# Altium project ArcNano_Project_v1.0.PrjPcb
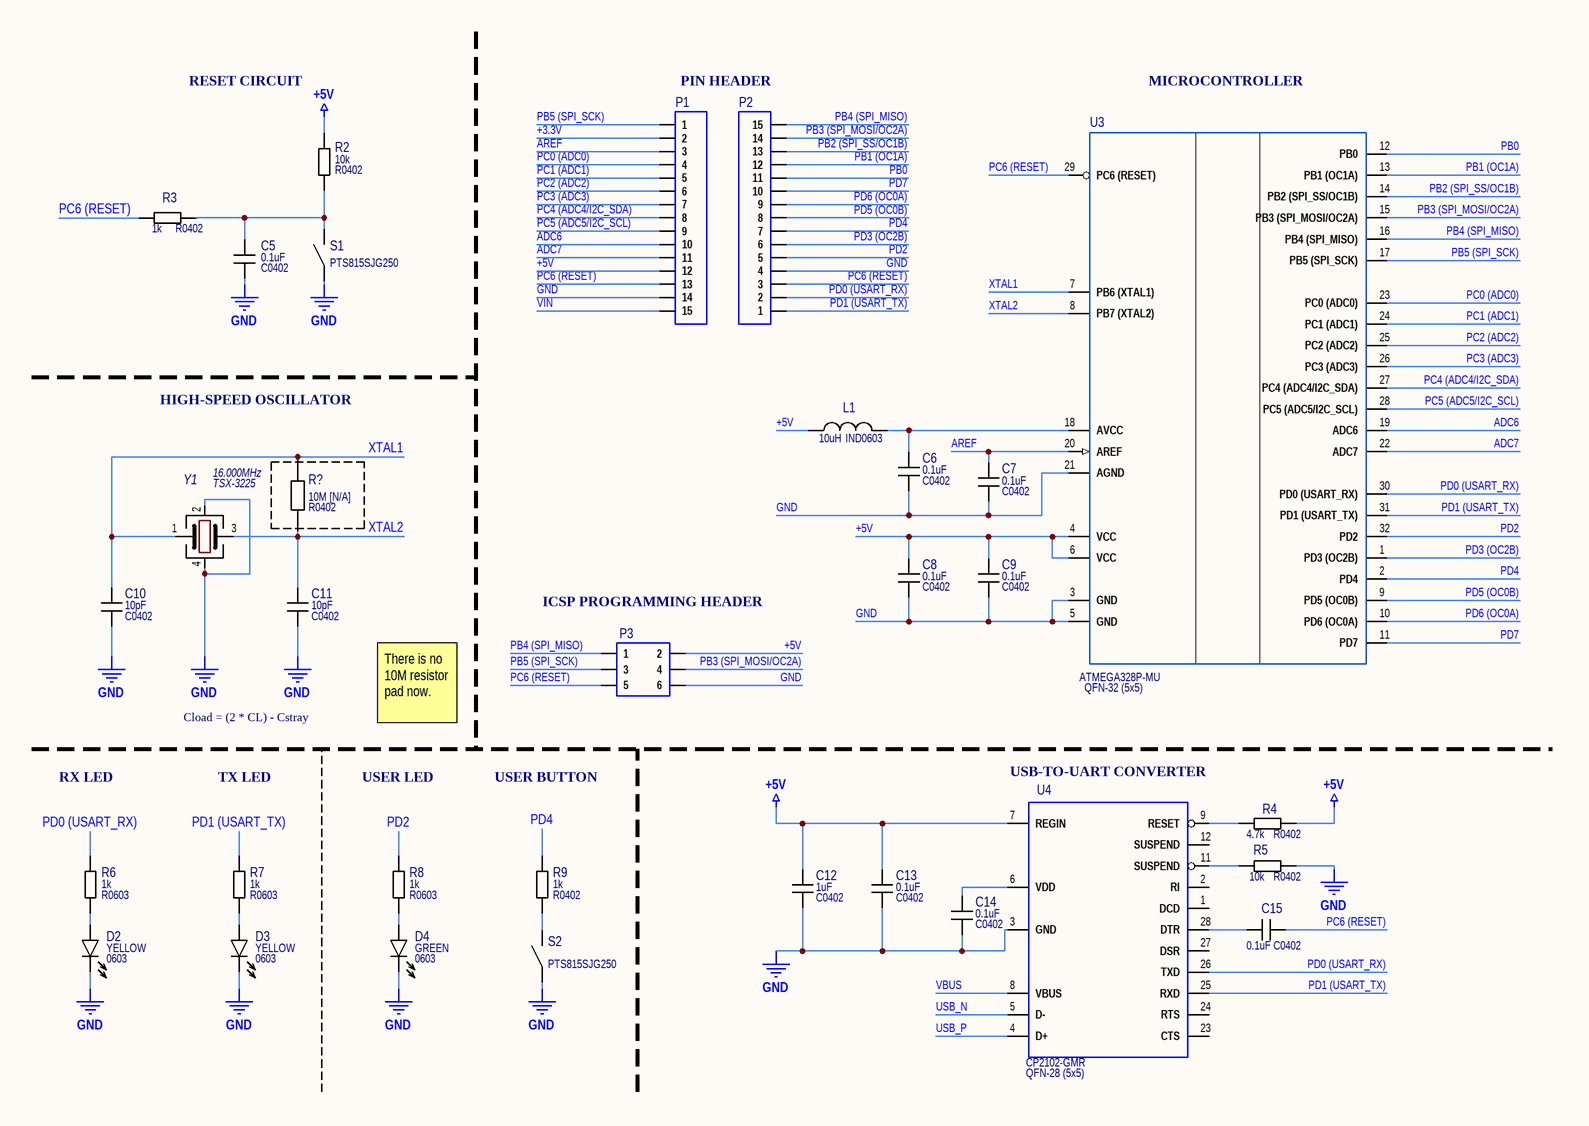
[diagram p0: ArcNano_Schematic_MCU.SchDoc]
1 sheet, 32 parts. Net scope: global (net labels, ports and power ports of the same name join across sheets).
Board file: ArcNano_PCB.PcbDoc

## Sheet ArcNano_Schematic_MCU.SchDoc
size 297 x 209 mm; SheetNumber: 2; SheetTotal: 2

### Parts
C5  value 0.1uF  [C0402]
C6  value 0.1uF  [C0402]
C7  value 0.1uF  [C0402]
C8  value 0.1uF  [C0402]
C9  value 0.1uF  [C0402]
C10  value 10pF  [C0402]
C11  value 10pF  [C0402]
C12  value 1uF  [C0402]
C13  value 0.1uF  [C0402]
C14  value 0.1uF  [C0402]
C15  value 0.1uF  [C0402]
D2  value YELLOW  Case: 0603  [D0603_LED_YELLOW]
D3  value YELLOW  Case: 0603  [D0603_LED_YELLOW]
D4  value GREEN  Case: 0603  [D0603_LED_GREEN]
L1  value 10uH  [IND0603]
P1  Header 15  [CONN-15 1x15 MALE]  (value not drawn)
P2  Header 15  [CONN-15 1x15 MALE]  (value not drawn)
P3  Connector 2x3 0.1"  [CONN-6 2x3 MALE]  (value not drawn)
R2  value 10k  [R0402]
R3  value 1k  [R0402]
R4  value 4.7k  [R0402]
R5  value 10k  [R0402]
R6  value 1k  [R0603]
R7  value 1k  [R0603]
R8  value 1k  [R0603]
R9  value 1k  [R0402]
R?  value 10M [N/A]  Case: R0402  [R0603]  (graphical)
S1  Model: PTS815SJG250  [PTS815SJG250SMTRLFS]
S2  Model: PTS815SJG250  [PTS815SJG250SMTRLFS]
U3  Case: QFN-32 (5x5)  Model: ATMEGA328P-MU  [QFN-32 (5x5)  Thermal Pad]  (hidden comment: ATmega328P)
U4  Case: QFN-28 (5x5)  Model: CP2102-GMR  [QFN-28 (5x5) Thermal Pad]
Y1  16.000MHz  [TSX-3225]

### Nets
+5V: C8.2 C9.2 C12.2 C13.2 L1.1 P1.12 P3.2 R2.2 R4.2 U3.4(VCC) U3.6(VCC) U4.7(REGIN)
GND: C5.1 C6.1 C7.1 C8.1 C9.1 C10.1 C11.1 C12.1 C13.1 C14.1 D2.2 D3.2 D4.2 P1.14 P2.4 P3.6 R5.1 S1.1 S2.1 U3.3(GND) U3.5(GND) U3.21(AGND) U4.3(GND) Y1.2 Y1.4
+3.3V: P1.2
ADC6: P1.10 U3.19(ADC6)
ADC7: P1.11 U3.22(ADC7)
AREF: C7.2 P1.3 U3.20(AREF)
PB0: P2.11 U3.12(PB0)
PB1 (OC1A): P2.12 U3.13(PB1_(OC1A))
PB2 (SPI_SS/OC1B): P2.13 U3.14(PB2_(SPI_SS/OC1B))
PB3 (SPI_MOSI/OC2A): P2.14 P3.4 U3.15(PB3_(SPI_MOSI/OC2A))
PB4 (SPI_MISO): P2.15 P3.1 U3.16(PB4_(SPI_MISO))
PB5 (SPI_SCK): P1.1 P3.3 U3.17(PB5_(SPI_SCK))
PC0 (ADC0): P1.4 U3.23(PC0_(ADC0))
PC1 (ADC1): P1.5 U3.24(PC1_(ADC1))
PC2 (ADC2): P1.6 U3.25(PC2_(ADC2))
PC3 (ADC3): P1.7 U3.26(PC3_(ADC3))
PC4 (ADC4/I2C_SDA): P1.8 U3.27(PC4_(ADC4/I2C_SDA))
PC5 (ADC5/I2C_SCL): P1.9 U3.28(PC5_(ADC5/I2C_SCL))
PC6 (RESET): C15.1 P1.13 P2.3 P3.5 R3.1 U3.29(PC6_(RESET))
PD0 (USART_RX): P2.2 R6.1 U3.30(PD0_(USART_RX)) U4.26(TXD)
PD1 (USART_TX): P2.1 R7.1 U3.31(PD1_(USART_TX)) U4.25(RXD)
PD2: P2.5 R8.1 U3.32(PD2)
PD3 (OC2B): P2.6 U3.1(PD3_(OC2B))
PD4: P2.7 R9.1 U3.2(PD4)
PD5 (OC0B): P2.8 U3.9(PD5_(OC0B))
PD6 (OC0A): P2.9 U3.10(PD6_(OC0A))
PD7: P2.10 U3.11(PD7)
USB_N: U4.5(D-)
USB_P: U4.4(D+)
VBUS: U4.8(VBUS)
VIN: P1.15
XTAL1: C10.2 R?.2 U3.7(PB6_(XTAL1)) Y1.1
XTAL2: C11.2 R?.1 U3.8(PB7_(XTAL2)) Y1.3
NetC5_2: C5.2 R2.1 R3.2 S1.2
NetC6_2: C6.2 L1.2 U3.18(AVCC)
NetC14_2: C14.2 U4.6(VDD)
NetC15_2: C15.2 U4.28(DTR)
NetD2_1: D2.1 R6.2
NetD3_1: D3.1 R7.2
NetD4_1: D4.1 R8.2
NetR4_1: R4.1 U4.9(RESET)
NetR5_2: R5.2 U4.11(SUSPEND)
NetR9_2: R9.2 S2.2

Not connected (* = marked no-connect by the designer): U4 1(DCD) 2(RI) 12(SUSPEND) 23(CTS) 24(RTS) 27(DSR)

### Notes on the sheet
- RESET CIRCUIT
- PIN HEADER
- MICROCONTROLLER
- HIGH-SPEED OSCILLATOR
- (near P3) ICSP PROGRAMMING HEADER
- Cload = (2 * CL) - Cstray
- There is no 10M resistor pad now.
- RX LED
- TX LED
- USER LED
- USER BUTTON
- (near U4) USB-TO-UART CONVERTER

### Library data of the parts
C5-C9 C13-C15 = Capacitor: Manufacturer: Murata Electronics; Model: GRM155R71H104KE14D; HelpURL: https://lcsc.com/product-detail/Multilayer-Ceramic-Capacitors-MLCC-SMD-SMT_Murata-Electronics-GRM155R71H104KE14D_C77020.html; Case: C0402; JLCPCB Part #: C77020; MFR.Part #: GRM155R71H104KE14D
C10 C11 = Capacitor: Manufacturer: Samsung Electro-Mechanics; Model: CL05C100JB5NNNC; HelpURL: https://lcsc.com/product-detail/Multilayer-Ceramic-Capacitors-MLCC-SMD-SMT_Samsung-Electro-Mechanics-CL05C100JB5NNNC_C32949.html; Case: C0402; JLCPCB Part #: C32949; MFR.Part #: CL05C100JB5NNNC
C12 = Capacitor: Manufacturer: Murata Electronics; Model: GCM155C71A105KE38D; HelpURL: https://lcsc.com/product-detail/Multilayer-Ceramic-Capacitors-MLCC-SMD-SMT_Murata-Electronics-GCM155C71A105KE38D_C126521.html; Case: C0402; JLCPCB Part #: C126521; MFR.Part #: GCM155C71A105KE38D
D2 D3 = LED: LED Indication - Discrete 1.95V; Manufacturer: Everlight Elec; Model: 19-213/Y2C-CQ2R2L/3T(CY); HelpURL: https://lcsc.com/product-detail/Light-Emitting-Diodes-LED_Everlight-Elec-19-213-Y2C-CQ2R2L-3T-CY_C72038.html; JLCPCB Part #: C72038; MFR.Part #: 19-213/Y2C-CQ2R2L/3T(CY)
D4 = LED: Manufacturer: Everlight Elec; Model: 19-217/GHC-YR1S2/3T; HelpURL: https://lcsc.com/product-detail/Light-Emitting-Diodes-LED_Everlight-Elec-19-217-GHC-YR1S2-3T_C72043.html; JLCPCB Part #: C72043; MFR.Part #: 19-217/GHC-YR1S2/3T
L1 = Inductor: Manufacturer: Sunlord; Model: SDFL1608S100KTF; HelpURL: https://lcsc.com/product-detail/Inductors-SMD_Sunlord-SDFL1608S100KTF_C1035.html; Case: IND0603; JLCPCB Part #: C1035; MFR.Part #: SDFL1608S100KTF
P1 P2 = Connector 1x15 0.1": Manufacturer: Ckmtw(Shenzhen Cankemeng); MFR.Part #: B-2100S15P-A110; Value: 1x15; Model: *; Case: 1x15; HelpURL: https://lcsc.com/product-detail/Pin-Headers_Ckmtw-Shenzhen-Cankemeng-B-2100S15P-A110_C124373.html; JLCPCB Part #: C124373
P3 = Connector 2x3 0.1": Manufacturer: Amphenol ICC; MFR.Part #: 67996-106HLF; Model: *; Case: 2x3; HelpURL: https://lcsc.com/product-detail/Pin-Headers_Amphenol-ICC-67996-106HLF_C412086.html; Value: 2x3; JLCPCB Part #: C412086
R2 R5 = Resistor: Manufacturer: YAGEO; Model: RC0402JR-0710KL; HelpURL: https://lcsc.com/product-detail/Chip-Resistor-Surface-Mount_YAGEO-RC0402JR-0710KL_C60489.html; Case: R0402; JLCPCB Part #: C60489; MFR.Part #: RC0402JR-0710KL
R3 R9 = Resistor: Manufacturer: YAGEO; Model: RC0402JR-071KL; HelpURL: https://lcsc.com/product-detail/Chip-Resistor-Surface-Mount_YAGEO-RC0402JR-071KL_C105637.html; Case: R0402; JLCPCB Part #: C105637; MFR.Part #: RC0402JR-071KL
R4 = Resistor: Manufacturer: YAGEO; Model: RC0402JR-074K7L; HelpURL: https://lcsc.com/product-detail/Chip-Resistor-Surface-Mount_YAGEO-RC0402JR-074K7L_C105870.html; Case: R0402; JLCPCB Part #: C105870; MFR.Part #: RC0402JR-074K7L
R6-R8 = Resistor: Manufacturer: YAGEO; Model: RC0603JR-071KL; HelpURL: https://lcsc.com/product-detail/Chip-Resistor-Surface-Mount_YAGEO-RC0603JR-071KL_C14676.html; Case: R0603; JLCPCB Part #: C14676; MFR.Part #: RC0603JR-071KL
R? = Resistor: Model: RC0402JR-0710ML; Manufacturer: *; HelpURL: https://www.chipdip.by/product0/9000189976
S1 S2 = Button: Manufacturer: C&K; Case: 3.2x2.5mm; HelpURL: https://lcsc.com/product-detail/Tactile-Switches_C-K-PTS815SJG250SMTRLFS_C411883.html; JLCPCB Part #: C411883; MFR.Part #: PTS815SJG250SMTRLFS
U3 = ATmega328P: AVR series Microcontroller IC 8-Bit; Manufacturer: Microchip Technology; HelpURL: https://lcsc.com/product-detail/ATMEL-AVR_Microchip-Tech-ATMEGA328P-MU_C38896.html; JLCPCB Part #: C38896; MFR.Part #: ATMEGA328P-MU
U4 = CP2102: USB Bridge, USB to UART USB 2.0 UART Interface; Manufacturer: Silicon Laboratories; HelpURL: https://lcsc.com/product-detail/USB-ICs_SILICON-LABS-CP2102-GMR_C6568.html; JLCPCB Part #: C6568; MFR.Part #: CP2102-GMR
Y1 = Crystal_TSX-3225: CRYSTAL 24.0000MHZ 9PF SMD; Manufacturer: Yangxing Tech; Model: X322516MLB4SI; HelpURL: https://lcsc.com/product-detail/Crystals_Yangxing-Tech-X322516MLB4SI_C13738.html; Value: 16.000MHz; Case: TSX-3225; JLCPCB Part #: C13738; MFR.Part #: X322516MLB4SI